# Altium project MiniUIOD_AP.PrjPcb
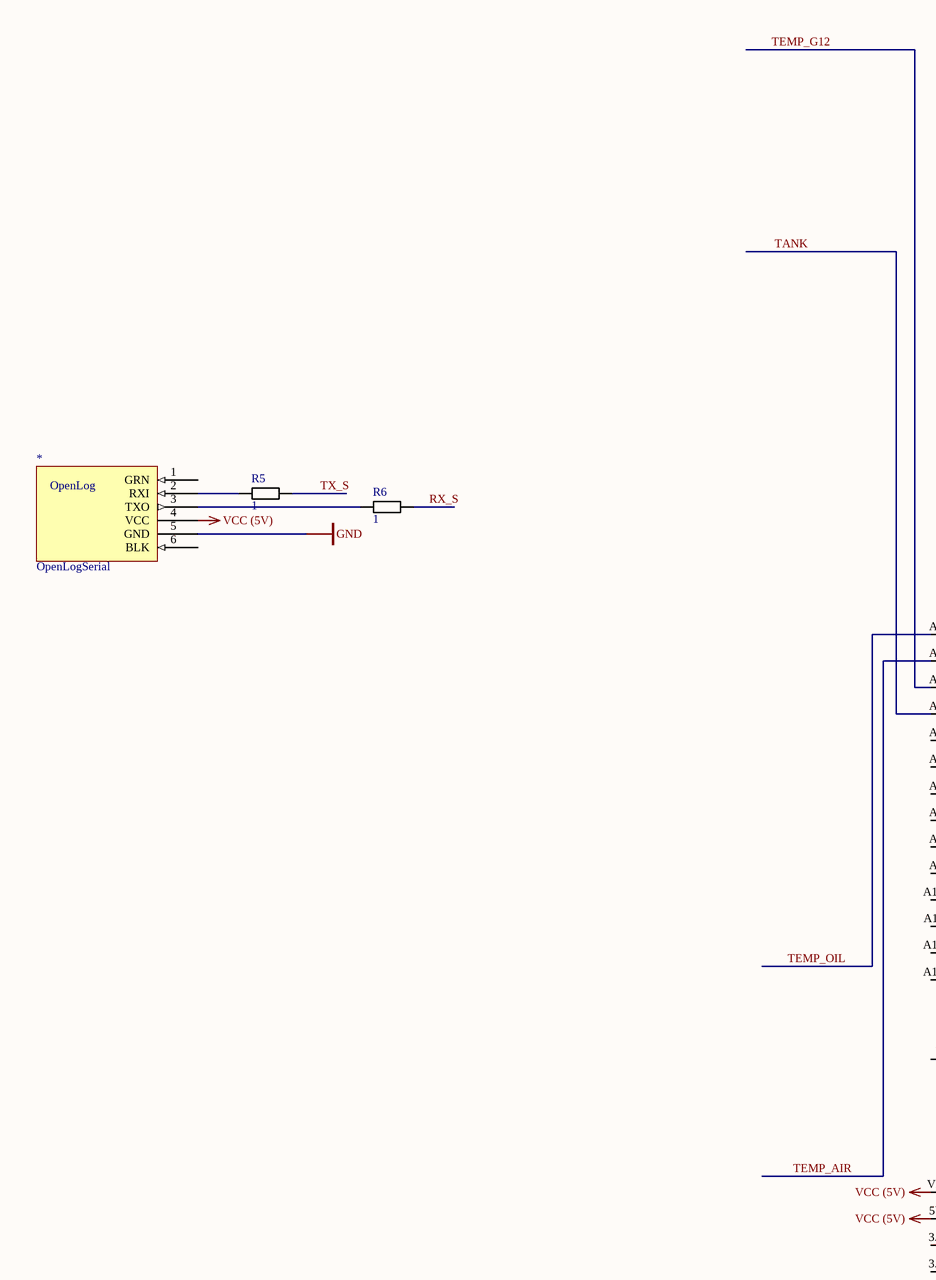
[diagram p0: MiniUIOD_AP.SchDoc, left]
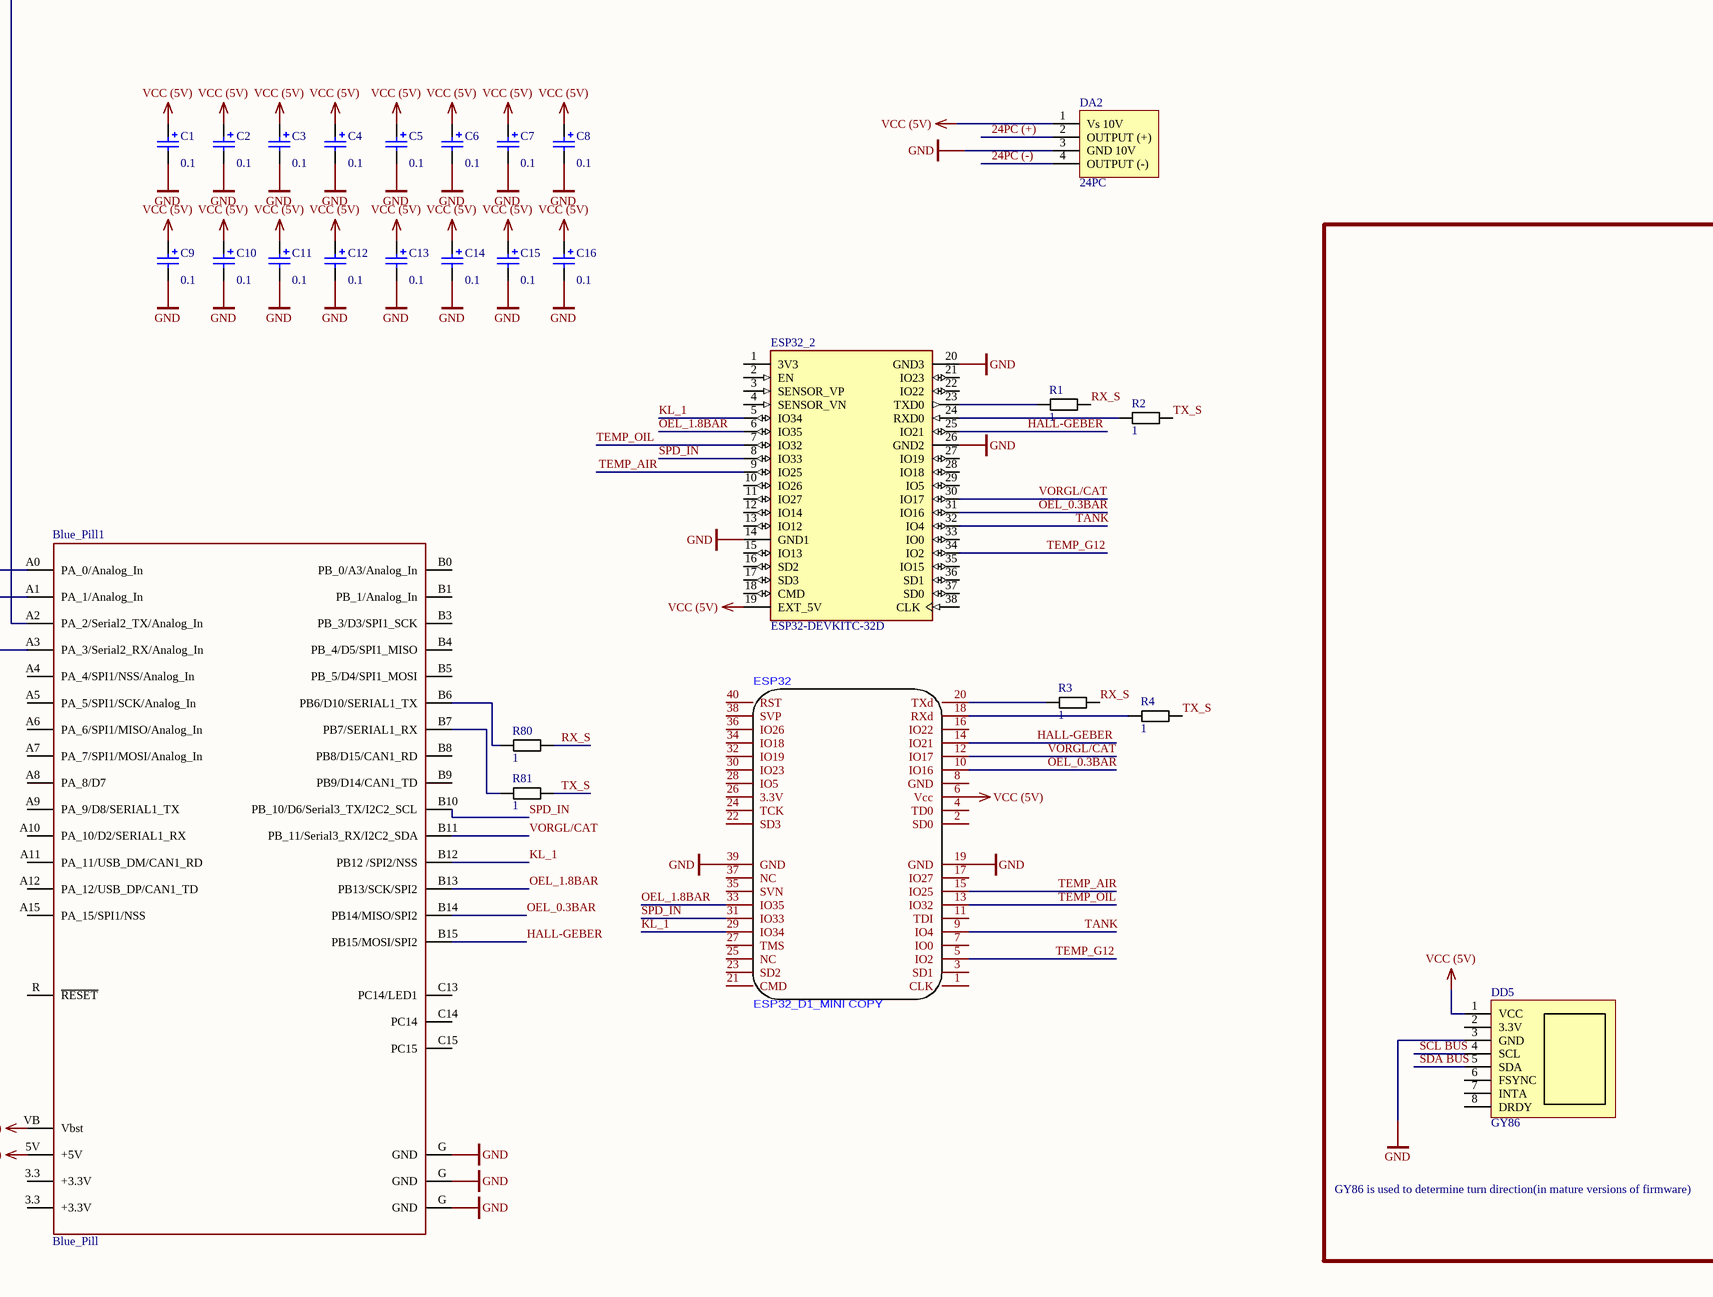
[diagram p1: MiniUIOD_AP.SchDoc, right]
1 sheet, 30 parts. Net scope: global (net labels, ports and power ports of the same name join across sheets).
Board file: MiniUIOD_AP.PcbDoc

## Sheet MiniUIOD_AP.SchDoc
size A2

### Parts
*  OpenLogSerial  [OpenLogSerial]
Blue_Pill1  Blue_Pill  [BLUE_PILL]
C1  value 0.1  [C0805]  (hidden comment: Cap Pol3)
C2  value 0.1  [C0805]  (hidden comment: Cap Pol3)
C3  value 0.1  [C0805]  (hidden comment: Cap Pol3)
C4  value 0.1  [C0805]  (hidden comment: Cap Pol3)
C5  value 0.1  [C0805]  (hidden comment: Cap Pol3)
C6  value 0.1  [C0805]  (hidden comment: Cap Pol3)
C7  value 0.1  [C0805]  (hidden comment: Cap Pol3)
C8  value 0.1  [C0805]  (hidden comment: Cap Pol3)
C9  value 0.1  [C0805]  (hidden comment: Cap Pol3)
C10  value 0.1  [C0805]  (hidden comment: Cap Pol3)
C11  value 0.1  [C0805]  (hidden comment: Cap Pol3)
C12  value 0.1  [C0805]  (hidden comment: Cap Pol3)
C13  value 0.1  [C0805]  (hidden comment: Cap Pol3)
C14  value 0.1  [C0805]  (hidden comment: Cap Pol3)
C15  value 0.1  [C0805]  (hidden comment: Cap Pol3)
C16  value 0.1  [C0805]  (hidden comment: Cap Pol3)
DA2  24PC  [24PC]
DD5  GY86  [GY86_MODEL]
ESP32  ESP32_D1_MINI COPY  [ESP32_MINI_MHET]
ESP32_2  ESP32-DEVKITC-32D  [MODULE_ESP32-DEVKITC-32D]
R1  1  [SMT0603/VISHAY]
R2  1  [SMT0603/VISHAY]
R3  1  [SMT0603/VISHAY]
R4  1  [SMT0603/VISHAY]
R5  1  [SMT0603/VISHAY]
R6  1  [SMT0603/VISHAY]
R80  1  [SMT0603/VISHAY]
R81  1  [SMT0603/VISHAY]

### Nets
GND: *.5(GND) Blue_Pill1.G(GND) C1.2 C2.2 C3.2 C4.2 C5.2 C6.2 C7.2 C8.2 C9.2 C10.2 C11.2 C12.2 C13.2 C14.2 C15.2 C16.2 DA2.3(GND_10V) DD5.3(GND) ESP32.19(GND) ESP32.39(GND) ESP32_2.14(GND1) ESP32_2.20(GND3) ESP32_2.26(GND2)
VCC (5V): *.4(VCC) Blue_Pill1.5V(+5V) Blue_Pill1.VB(Vbst) C1.1 C2.1 C3.1 C4.1 C5.1 C6.1 C7.1 C8.1 C9.1 C10.1 C11.1 C12.1 C13.1 C14.1 C15.1 C16.1 DA2.1(Vs_10V) DD5.1(VCC) ESP32.6(Vcc) ESP32_2.19(EXT_5V)
24PC (+): DA2.2(OUTPUT_(+))
24PC (-): DA2.4(OUTPUT_(-))
HALL-GEBER: Blue_Pill1.B15(PB15/MOSI/SPI2) ESP32.14(IO21) ESP32_2.25(IO21)
KL_1: Blue_Pill1.B12(PB12_/SPI2/NSS) ESP32.29(IO34) ESP32_2.5(IO34)
OEL_0.3BAR: Blue_Pill1.B14(PB14/MISO/SPI2) ESP32.10(IO16) ESP32_2.31(IO16)
OEL_1.8BAR: Blue_Pill1.B13(PB13/SCK/SPI2) ESP32.33(IO35) ESP32_2.6(IO35)
RX_S: R1.1 R3.1 R6.1 R80.1
SCL BUS: DD5.4(SCL)
SDA BUS: DD5.5(SDA)
SPD_IN: Blue_Pill1.B10(PB_10/D6/Serial3_TX/I2C2_SCL) ESP32.31(IO33) ESP32_2.8(IO33)
TANK: Blue_Pill1.A3(PA_3/Serial2_RX/Analog_In) ESP32.9(IO4) ESP32_2.32(IO4)
TEMP_AIR: Blue_Pill1.A1(PA_1/Analog_In) ESP32.15(IO25) ESP32_2.9(IO25)
TEMP_G12: Blue_Pill1.A2(PA_2/Serial2_TX/Analog_In) ESP32.5(IO2) ESP32_2.34(IO2)
TEMP_OIL: Blue_Pill1.A0(PA_0/Analog_In) ESP32.13(IO32) ESP32_2.7(IO32)
TX_S: R2.1 R4.1 R5.1 R81.1
VORGL/CAT: Blue_Pill1.B11(PB_11/Serial3_RX/I2C2_SDA) ESP32.12(IO17) ESP32_2.30(IO17)
Net*_2: *.2(RXI) R5.2
Net*_3: *.3(TXO) R6.2
NetBlue_Pill1_B6: Blue_Pill1.B6(PB6/D10/SERIAL1_TX) R80.2
NetBlue_Pill1_B7: Blue_Pill1.B7(PB7/SERIAL1_RX) R81.2
NetESP32_2_23: ESP32_2.23(TXD0) R1.2
NetESP32_2_24: ESP32_2.24(RXD0) R2.2
NetESP32_18: ESP32.18(RXd) R4.2
NetESP32_20: ESP32.20(TXd) R3.2

Not connected (* = marked no-connect by the designer): * 1(GRN) 6(BLK); Blue_Pill1 3.3(+3.3V) A4(PA_4/SPI1/NSS/Analog_In) A5(PA_5/SPI1/SCK/Analog_In) A6(PA_6/SPI1/MISO/Analog_In) A7(PA_7/SPI1/MOSI/Analog_In) A8(PA_8/D7) A9(PA_9/D8/SERIAL1_TX) A10(PA_10/D2/SERIAL1_RX) A11(PA_11/USB_DM/CAN1_RD) A12(PA_12/USB_DP/CAN1_TD) A15(PA_15/SPI1/NSS) B0(PB_0/A3/Analog_In) B1(PB_1/Analog_In) B3(PB_3/D3/SPI1_SCK) B4(PB_4/D5/SPI1_MISO) B5(PB_5/D4/SPI1_MOSI) B8(PB8/D15/CAN1_RD) B9(PB9/D14/CAN1_TD) C13(PC14/LED1) C14(PC14) C15(PC15) R(~{RESET}); DD5 2(3.3V) 6(FSYNC) 7(INTA) 8(DRDY); ESP32 1(CLK) 2(SD0) 3(SD1) 4(TD0) 7(IO0) 8(GND) 11(TDI) 16(IO22) 17(IO27) 21(CMD) 22(SD3) 23(SD2) 24(TCK) 25(NC) 26(3.3V) 27(TMS) 28(IO5) 30(IO23) 32(IO19) 34(IO18) 35(SVN) 36(IO26) 37(NC) 38(SVP) 40(RST); ESP32_2 1(3V3) 2(EN) 3(SENSOR_VP) 4(SENSOR_VN) 10(IO26) 11(IO27) 12(IO14) 13(IO12) 15(IO13) 16(SD2) 17(SD3) 18(CMD) 21(IO23) 22(IO22) 27(IO19) 28(IO18) 29(IO5) 33(IO0) 35(IO15) 36(SD1) 37(SD0) 38(CLK)

### Notes on the sheet
- GY86 is used to determine turn direction(in mature versions of firmware)
- Title
- Size:
- Date:
- File:
- A2
- Number:
- Time:
- Revision:
- Sheet
- of
- (in symbol OpenLogSerial) OpenLog

### Library data of the parts
Blue_Pill1 = BluePill
C1-C16 = Cap Pol3: Polarized Capacitor (Surface Mount); Published: 8-Jun-2000; LatestRevisionDate: 29-May-2009; LatestRevisionNote: IPC-7351 Footprint Added.; PackageReference: C0805; Publisher: Altium Limited; PackageDescription: Chip Capacitor
DD5 = GY86_MODEL: ClassName: ICs
ESP32_2 = ESP32-DEVKITC-32D: EVAL BOARD FOR ESP-WROOM-32; MF: Espressif Systems; Value: *; MP: ESP32-DEVKITC-32D; Price: None; Check_prices: https://www.snapeda.com/parts/ESP32-DEVKITC-32D/Espressif%20Systems/view-part/2777395/?ref=eda; SnapEDA_Link: https://www.snapeda.com/parts/ESP32-DEVKITC-32D/Espressif%20Systems/view-part/2777395/?ref=snap; Availability: Warning; Purchase-URL: https://pricing.snapeda.com/search/part/ESP32-DEVKITC-32D/?ref=eda; Package: None
R1-R6 R80 R81 = CRCW0603_47
DA2 = 24PC: ClassName: ICs